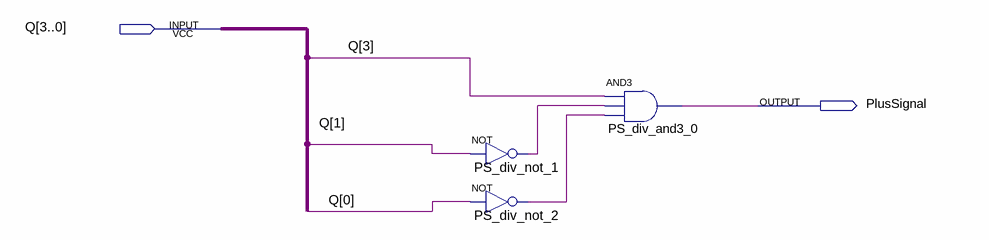
[diagram p0: schematic sheet]
// Quartus schematic PlusSignal_Division.bdf as structural Verilog: 3 symbols, 2 pins
module PlusSignal_Division (
  input  [3:0] Q,
  output PlusSignal
);

  wire PS_div_not_1_out, PS_div_not_2_out;

  not PS_div_not_1 (PS_div_not_1_out, Q[1]);
  not PS_div_not_2 (PS_div_not_2_out, Q[0]);
  and PS_div_and3_0 (PlusSignal, Q[3], PS_div_not_1_out, PS_div_not_2_out);
endmodule
